# Altium schematic sheet EBAZ4205扩展_EPD_TX.SchDoc
size A4; DocumentNumber: 5; SheetNumber: 4; SheetTotal: 4
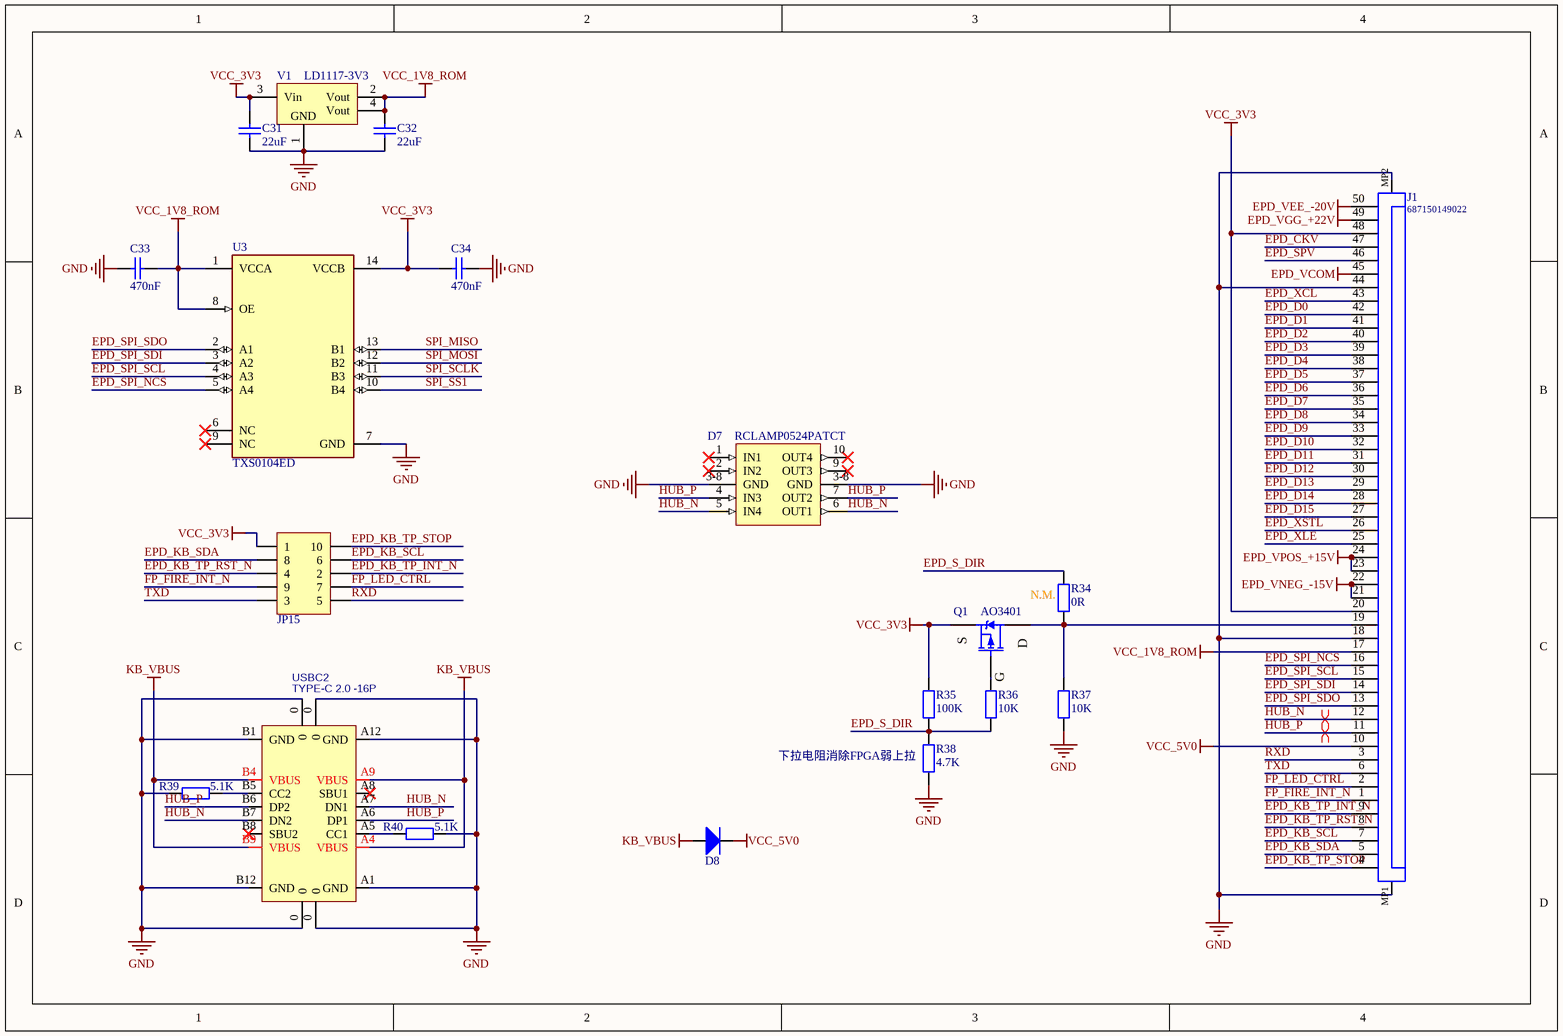
[diagram p0: EBAZ4205扩展_EPD_TX.SchDoc]

## Parts
C31  22uF  [C0603_L]
C32  22uF  [C0603_L]
C33  470nF  [C0603_L]
C34  470nF  [C0603_L]
D7  RCLAMP0524PATCT  [FP-SLP2510P8-MFG]
D8  TVS  [SOD-123]  (value not drawn)
J1  687150149022  [687150149022]
JP15  Header 5X2  [HDR2.54-LI-2x5P]  (value not drawn)
Q1  AO3401  [SOT23-3N]
R34  0R  [R0402_L]
R35  100K  [R0402_L]
R36  10K  [R0402_L]
R37  10K  [R0402_L]
R38  4.7K  [R0402_L]
R39  5.1K  [R0402_L]
R40  5.1K  [R0402_L]
U3  TXS0104ED  [FP-D0014A-IPC_C]
USBC2  TYPE-C 2.0 -16P  [USB-C-SMD_16P]
V1  LD1117-3V3  [SOT223_L]

## Nets
EPD_VCOM: J1.45
EPD_VEE_-20V: J1.50
EPD_VGG_+22V: J1.49
EPD_VNEG_-15V: J1.21 J1.22
EPD_VPOS_+15V: J1.23 J1.24
GND: C31.1 C32.1 C33.1 C34.2 D7.3-8(GND) J1.18 J1.44 J1.MP1 J1.MP2 R37.2 R38.1 R39.2 R40.1 U3.7(GND) USBC2.0 USBC2.A1(GND) USBC2.A12(GND) USBC2.B1(GND) USBC2.B12(GND) V1.1(GND)
KB_VBUS: D8.1(A) USBC2.A4(VBUS) USBC2.A9(VBUS) USBC2.B4(VBUS) USBC2.B9(VBUS)
VCC_1V8_ROM: C32.2 C33.2 J1.17 U3.1(VCCA) U3.8(OE) V1.2(Vout) V1.4(Vout)
VCC_3V3: C31.2 C34.1 J1.20 J1.48 JP15.1 Q1.2(S) R35.1 U3.14(VCCB) V1.3(Vin)
VCC_5V0: D8.2(K) J1.10
EPD_CKV: J1.47
EPD_D0: J1.42
EPD_D1: J1.41
EPD_D2: J1.40
EPD_D3: J1.39
EPD_D4: J1.38
EPD_D5: J1.37
EPD_D6: J1.36
EPD_D7: J1.35
EPD_D8: J1.34
EPD_D9: J1.33
EPD_D10: J1.32
EPD_D11: J1.31
EPD_D12: J1.30
EPD_D13: J1.29
EPD_D14: J1.28
EPD_D15: J1.27
EPD_KB_SCL: J1.7 JP15.6
EPD_KB_SDA: J1.5 JP15.8
EPD_KB_TP_INT_N: J1.9 JP15.2
EPD_KB_TP_RST_N: J1.8 JP15.4
EPD_KB_TP_STOP: J1.4 JP15.10
EPD_S_DIR: R34.1 R35.2 R36.2 R38.2
EPD_SPI_NCS: J1.16 U3.5(A4)
EPD_SPI_SCL: J1.15 U3.4(A3)
EPD_SPI_SDI: J1.14 U3.3(A2)
EPD_SPI_SDO: J1.13 U3.2(A1)
EPD_SPV: J1.46
EPD_XCL: J1.43
EPD_XLE: J1.25
EPD_XSTL: J1.26
FP_FIRE_INT_N: J1.1 JP15.9
FP_LED_CTRL: J1.2 JP15.7
HUB_N: D7.5(IN4) D7.6(OUT1) J1.12 USBC2.A7(DN1) USBC2.B7(DN2)
HUB_P: D7.4(IN3) D7.7(OUT2) J1.11 USBC2.A6(DP1) USBC2.B6(DP2)
RXD: J1.3 JP15.5
SPI_MISO: U3.13(B1)
SPI_MOSI: U3.12(B2)
SPI_SCLK: U3.11(B3)
SPI_SS1: U3.10(B4)
TXD: J1.6 JP15.3
NetJ1_19: J1.19 Q1.3(D) R34.2 R37.1
NetQ1_1: Q1.1(G) R36.1
NetR39_1: R39.1 USBC2.B5(CC2)
NetR40_2: R40.2 USBC2.A5(CC1)

Not connected (* = marked no-connect by the designer): D7 1(IN1)* 2(IN2)* 9(OUT3)* 10(OUT4)*; U3 6(NC)* 9(NC)*; USBC2 A8(SBU1)* B8(SBU2)*

## Layout directives
differential pair: HUB_N, HUB_P

## Notes on the sheet
- (near R34) N.M.
- 下拉电阻消除FPGA弱上拉

## Library data of the parts
C31-C34 = C: 贴片电容; BOM名称: 无极性贴片电容; 联系卖家，免费查找封装: 唯一出售店铺网址https://shop463601444.taobao.com
D7 = RCLAMP0524PATCT: TVS DIODE 5V 15V SLP2510P8; Number of Unidirectional Channels: 4; Min Breakdown Voltage: 6V; Direction: Unidirectional; Power Line Protection: Yes; Peak Pulse Power: 150W; Leakage Current: 1uA; Capacitance: 0.8pF; Peak Pulse Current: 1A; Series: RailClamp®; Min Operating Temperature: -55°C; Number of Bidirectional Channels: 4; Mount: Surface Mount; Clamping Voltage: 15V; Clamping Voltage-Max: 15V; Max Operating Temperature: 125°C; Working Voltage: 5V; Case/Package: SMD/SMT; Packaging: Tape and Reel; RoHS Compliant: Yes; Reverse Standoff Voltage: 5V; Radiation Hardening: No; Number of Pins: 10; Depth: 1mm; Length: 2.5mm
D8 = TVS: TVS通用; 联系卖家，免费查找封装: 唯一出售店铺网址https://shop463601444.taobao.com; Code_JEDEC: DO-214-AB
J1 = CMP-1502-01644-1: SMT ZIF Connectors Hinge Type WR-FPC, Horizontal, Bottom Contact, pitch 0.5 mm, 50 pins; Manufacturer: Wurth Elektronik; Pin Number: 50; Contact Resistance: 50mOhm; Working Voltage: 50VAC; Withstanding Voltage: 150VAC; Rated Current: 0.5A; Pitch: 0.5mm; Contact Design: BottomContact; Datasheet URL: https://katalog.we-online.de/em/datasheet/687150149022.pdf; Part Number: 687150149022; Packaging: TapeandReel; Mounting Technology: SMT; Operating Temperature: -40to105degC; Orientation: Horizontal; Publisher: WurthElektronik; Manufacturer URL: http://www.we-online.de; Package Reference: 687150149022
JP15 = Header 5X2: 5*2P接插件; 封装库来自淘宝卖家 ID：黄晶宝石: 其他店铺购入均为盗版假冒封装库; 联系卖家，免费查找封装: 唯一出售店铺网址https://shop463601444.taobao.com; BOM名称: 5*2P接插件
Q1 = AO3401: P沟道 30V/4.2A; BOM名称: 场效应管; 封装库来自淘宝卖家 ID：黄晶宝石: 其他店铺购入均为盗版，不享受售后技术支持服务，请立即申请退款; 联系卖家，免费查找封装: 唯一出售店铺网址https://shop463601444.taobao.com; 参数: P沟道 30V/4.2A
R34-R37 R39 R40 = R: 贴片电阻; 联系卖家，免费查找封装: 唯一出售店铺网址https://shop463601444.taobao.com; 封装库来自淘宝卖家ID：黄晶宝石: 其他店铺购入均为盗版假冒封装库，请立即申请退款; BOM名称: 贴片电阻
R38 = R: 贴片电阻; 3.交流分享: Q群514746572,开源更新,欢迎一起交流学习PCB设计; 4.作者声明: 旨为整合最全库集,欢迎转载,禁止商用！-冰凌猫; 5.备注说明: 该库已二次整合过网上各热销库,基本最全,无需重复搜购安装; 1.库作者: 冰凌猫; 2.库版本: v2.0 (2021.03.30); 0.0_BOM名称: 贴片电阻
U3 = CMP-04899-000005-1: IC TRNSLTR BIDIRECTIONAL 14SOIC; Manufacturer: Texas Instruments; Min Supply Voltage: 1.65V; V A Min: 1.25V; Standoff Height: 0.1mm; Max Junction Temp: +150°C; Nominal Supply Current: 14.4uA; Data Rate: 24Mbits/s; Number Of Outputs: 4; V B Max: 4.4V; V B Min: 0.4V; Propagation Delay: 165ns; Number Of Circuits: 1; Max Supply Voltage: 5.5V; V A Max: 3.6V; Logic Function Desc: Non-Inverting; Ambient Temperature Range High: +85°C; Category: IC; Device Class L1: Integrated Circuits (ICs); Ambient Temperature Range Low: -40°C; Height: 1.75mm; Digikey Description: IC TRNSLTR BIDIRECTIONAL 14SOIC; Device Class L2: Logic ICs; Automotive: No; Mouser Description: 4-Bit Bidirectional Voltage-Level Shifter for Open-Drain and Push-Pull Applications 14-SOIC -40 to 85; Lead Free: Yes; Temperature Range High: +85°C; ComponentLink2URL: http://www.ti.com/lit/ds/symlink/txs0104e.pdf; ComponentLink2Description: Datasheet; Manufacturer Part Number: TXS0104ED; Device Class L3: Voltage Level Shifters; RoHS: TRUE; Temperature: -40°C to +85°C; Package: D0014A; Number Of Inputs: 4; Temperature Range Low: -40°C; Octopart: https://octopart.com/txs0104ed-texas+instruments-1486620
USBC2 = USB2.0_Type-C_16Pin: USB2.0 Type-C 16Pin  母座; 联系卖家，免费技术支持: 唯一出售店铺网址https://shop463601444.taobao.com
V1 = LD1117: 三端稳压芯片; BOM名称: 稳压芯片; 封装库来自淘宝卖家 ID：黄晶宝石: 其他店铺购入均为盗版，请立即申请退款，本店现金奖励5~20元; 联系卖家 免费查找封装: 唯一出售店铺网址https://shop463601444.taobao.com